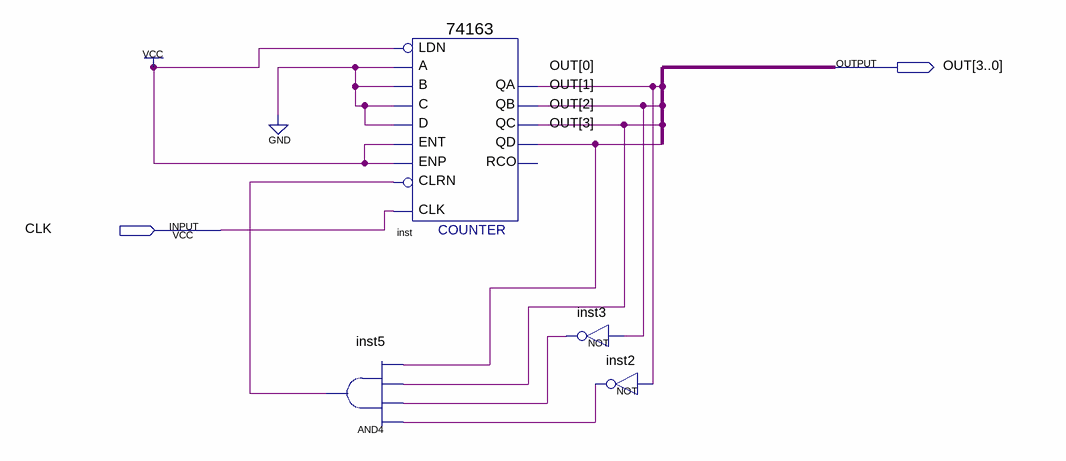
[diagram p0: schematic sheet]
// Quartus schematic SpecialCount.bdf as structural Verilog: 4 symbols, 2 pins
module SpecialCount (
  input  CLK,
  output [3:0] OUT
);

  wire inst2_out, inst3_out, inst5_out;

  and inst5 (inst5_out, inst2_out, inst3_out, OUT[2], OUT[3]);
  \74163  inst (
    .C(1'b0), .B(1'b0), .A(1'b0), .ENT(1'b1), .D(1'b0), .CLRN(inst5_out), .CLK(CLK), .ENP(1'b1), .LDN(1'b1),
    .QA(OUT[0]), .QB(OUT[1]), .QC(OUT[2]), .QD(OUT[3]));  // open: RCO
  not inst3 (inst3_out, OUT[1]);
  not inst2 (inst2_out, OUT[0]);
endmodule
